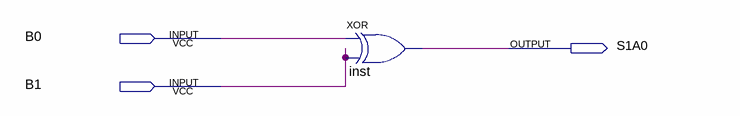
[diagram p0: schematic sheet]
// Quartus schematic S1(A0).bdf as structural Verilog: 1 symbols, 3 pins
module \S1(A0)  (
  input  B0,
  input  B1,
  output S1A0
);

  xor inst (S1A0, B0, B1);
endmodule
